# Altium project Pannel3.5x3.PrjPcb
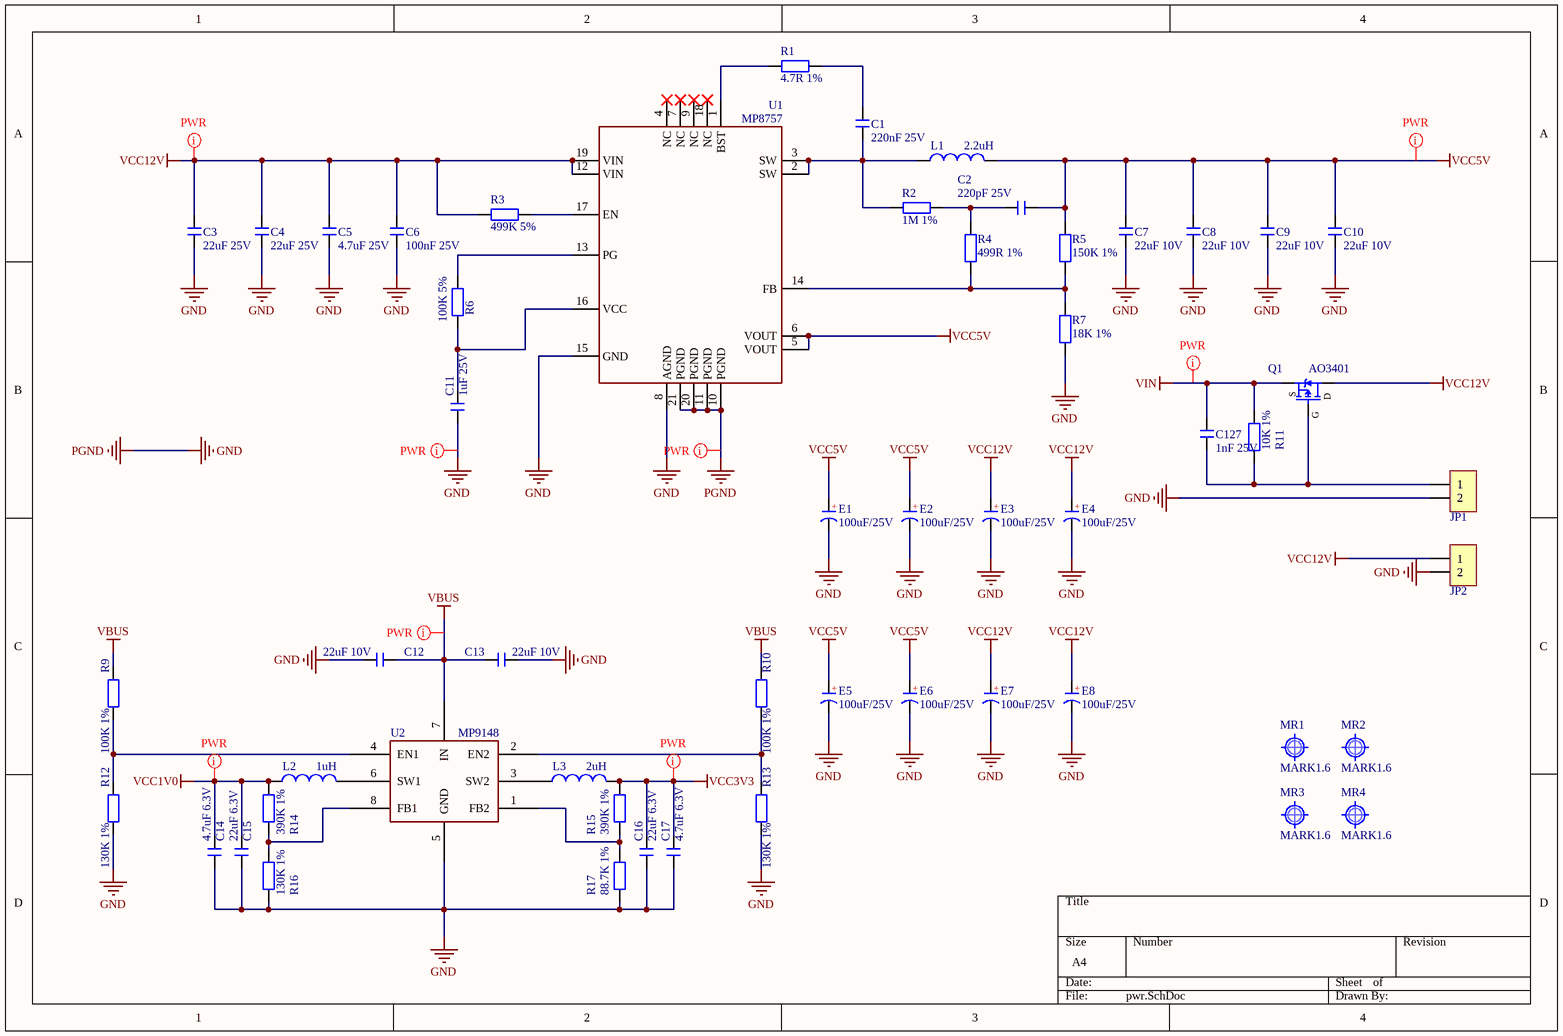
[diagram p0: pwr.SchDoc]
4 sheets, 234 parts. Net scope: global (net labels, ports and power ports of the same name join across sheets).
Board file: Pannel3.5x3.PcbDoc
Sheets:
  pwr.SchDoc
  connector.SchDoc
  jmb575.SchDoc
  vl822.SchDoc

## Sheet pwr.SchDoc
size A4; SheetNumber: 1; SheetTotal: 4

### Parts
C1  220nF 25V  [C0402_L]
C2  220pF 25V  [C0402_L]
C3  22uF 25V  [C0805_L]
C4  22uF 25V  [C0805_L]
C5  4.7uF 25V  [C0805_L]
C6  100nF 25V  [C0805_L]
C7  22uF 10V  [C0805_L]
C8  22uF 10V  [C0805_L]
C9  22uF 10V  [C0805_L]
C10  22uF 10V  [C0805_L]
C11  1uF 25V  [C0402_L]
C12  22uF 10V  [C0603_L]
C13  22uF 10V  [C0603_L]
C14  4.7uF 6.3V  [C0603_L]
C15  22uF 6.3V  [C0603_L]
C16  22uF 6.3V  [C0603_L]
C17  4.7uF 6.3V  [C0603_L]
C127  1nF 25V  [C0402_L]
E1  100uF/25V  [CS 6*4 - B]
E2  100uF/25V  [CS 6*4 - B]
E3  100uF/25V  [CS 6*4 - B]
E4  100uF/25V  [CS 6*4 - B]
E5  100uF/25V  [CS 6*4 - B]
E6  100uF/25V  [CS 6*4 - B]
E7  100uF/25V  [CS 6*4 - B]
E8  100uF/25V  [CS 6*4 - B]
JP1  HDR-1X2  [ZH1.5-WS-2P]  (value not drawn)
JP2  HDR-1X2  [XH2.54-WS-2P]  (value not drawn)
L1  2.2uH  [NR8040]
L2  1uH  [NR4020]
L3  2uH  [NR4020]
MR1  MARK1.6  [Mark 1]
MR2  MARK1.6  [Mark 1]
MR3  MARK1.6  [Mark 1]
MR4  MARK1.6  [Mark 1]
Q1  AO3401  [DFN8-L3.0-W3.0-P0.65_EP]
R1  4.7R 1%  [R0402_L]
R2  1M 1%  [R0402_L]
R3  499K 5%  [R0402_L]
R4  499R 1%  [R0402_L]
R5  150K 1%  [R0402_L]
R6  100K 5%  [R0402_L]
R7  18K 1%  [R0402_L]
R9  100K 1%  [R0402_L]
R10  100K 1%  [R0402_L]
R11  10K 1%  [R0402_L]
R12  130K 1%  [R0402_L]
R13  130K 1%  [R0402_L]
R14  390K 1%  [R0402_L]
R15  390K 1%  [R0402_L]
R16  130K 1%  [R0402_L]
R17  88.7K 1%  [R0402_L]
U1  MP8757  [MP8757]
U2  MP9148  [SOT23-8]

### Nets
GND: C3.1 C4.1 C5.1 C6.1 C7.1 C8.1 C9.1 C10.1 C11.1 C12.1 C13.1 C14.1 C15.1 C16.1 C17.1 E1.2(K) E2.2(K) E3.2(K) E4.2(K) E5.2(K) E6.2(K) E7.2(K) E8.2(K) JP1.2 JP2.2 R7.1 R12.2 R13.2 R16.2 R17.2 U1.8(AGND) U1.10(PGND) U1.11(PGND) U1.15(GND) U1.20(PGND) U1.21(PGND) U2.5(GND)  [also labelled PGND]
VBUS: C12.2 C13.2 R9.1 R10.1 U2.7(IN)
VCC1V0: C14.2 C15.2 L2.1 R14.1
VCC3V3: C16.2 C17.2 L3.1 R15.1
VCC5V: C2.1 C7.2 C8.2 C9.2 C10.2 E1.1(A) E2.1(A) E5.1(A) E6.1(A) L1.1 R5.2 U1.5(VOUT) U1.6(VOUT)
VCC12V: C3.2 C4.2 C5.2 C6.2 E3.1(A) E4.1(A) E7.1(A) E8.1(A) JP2.1 Q1.3(D) R3.1 U1.12(VIN) U1.19(VIN)
VIN: C127.1 Q1.2(S) R11.1
NetC1_1: C1.1 R1.2
NetC1_2: C1.2 L1.2 R2.1 U1.2(SW) U1.3(SW)
NetC2_2: C2.2 R2.2 R4.1
NetC11_2: C11.2 R6.1 U1.16(VCC)
NetC127_2: C127.2 JP1.1 Q1.1(G) R11.2
NetL2_2: L2.2 U2.6(SW1)
NetL3_2: L3.2 U2.3(SW2)
NetR1_1: R1.1 U1.1(BST)
NetR3_2: R3.2 U1.17(EN)
NetR4_2: R4.2 R5.1 R7.2 U1.14(FB)
NetR6_2: R6.2 U1.13(PG)
NetR9_2: R9.2 R12.1 U2.4(EN1)
NetR10_2: R10.2 R13.1 U2.2(EN2)
NetR14_2: R14.2 R16.1 U2.8(FB1)
NetR15_2: R15.2 R17.1 U2.1(FB2)

Not connected (* = marked no-connect by the designer): U1 4(NC)* 7(NC)* 9(NC)* 18(NC)*

### Layout directives
net class PWR: GND, VBUS, VCC1V0, VCC3V3, VCC5V, VCC12V, VIN

### Notes on the sheet
- (in symbol C-CD) +

### Library data of the parts
C1-C17 C127 = C: 无极性贴片电容; 版权归属: 源创客; 材质: X7R; BOM名称: 无极性贴片电容; 学习资源: www.ooocke.com
E1-E8 = C-CD: 贴片钽电容; 版权归属: 源创客; BOM名称: 贴片钽电容; 学习资源: www.ooocke.com
JP1 JP2 = Header 2: 2P接插件; 版权归属: 源创客; BOM名称: 2P接插件; 学习资源: www.ooocke.com
L1-L3 = L: 小功率贴片电感; 版权归属: 源创客; BOM名称: 小功率贴片电感; 学习资源: www.ooocke.com
MR1-MR4 = MARK: 光学定位点; 版权归属: 源创客; BOM名称: 光学定位点; 学习资源: www.ooocke.com
Q1 = AO3401: P沟道 30V/4.2A; BOM名称: 场效应管; 版权归属: 源创客; 学习资源: www.ooocke.com; 描述: P沟道 30V/4.2A
R1-R7 R9-R17 = R: 贴片电阻; 版权归属: 源创客; BOM名称: 贴片电阻; 学习资源: www.ooocke.com
U1 = MP8757: DCDC控制器
U2 = MP9148: BUCK

## Sheet connector.SchDoc
size A4; SheetNumber: 2; SheetTotal: 4
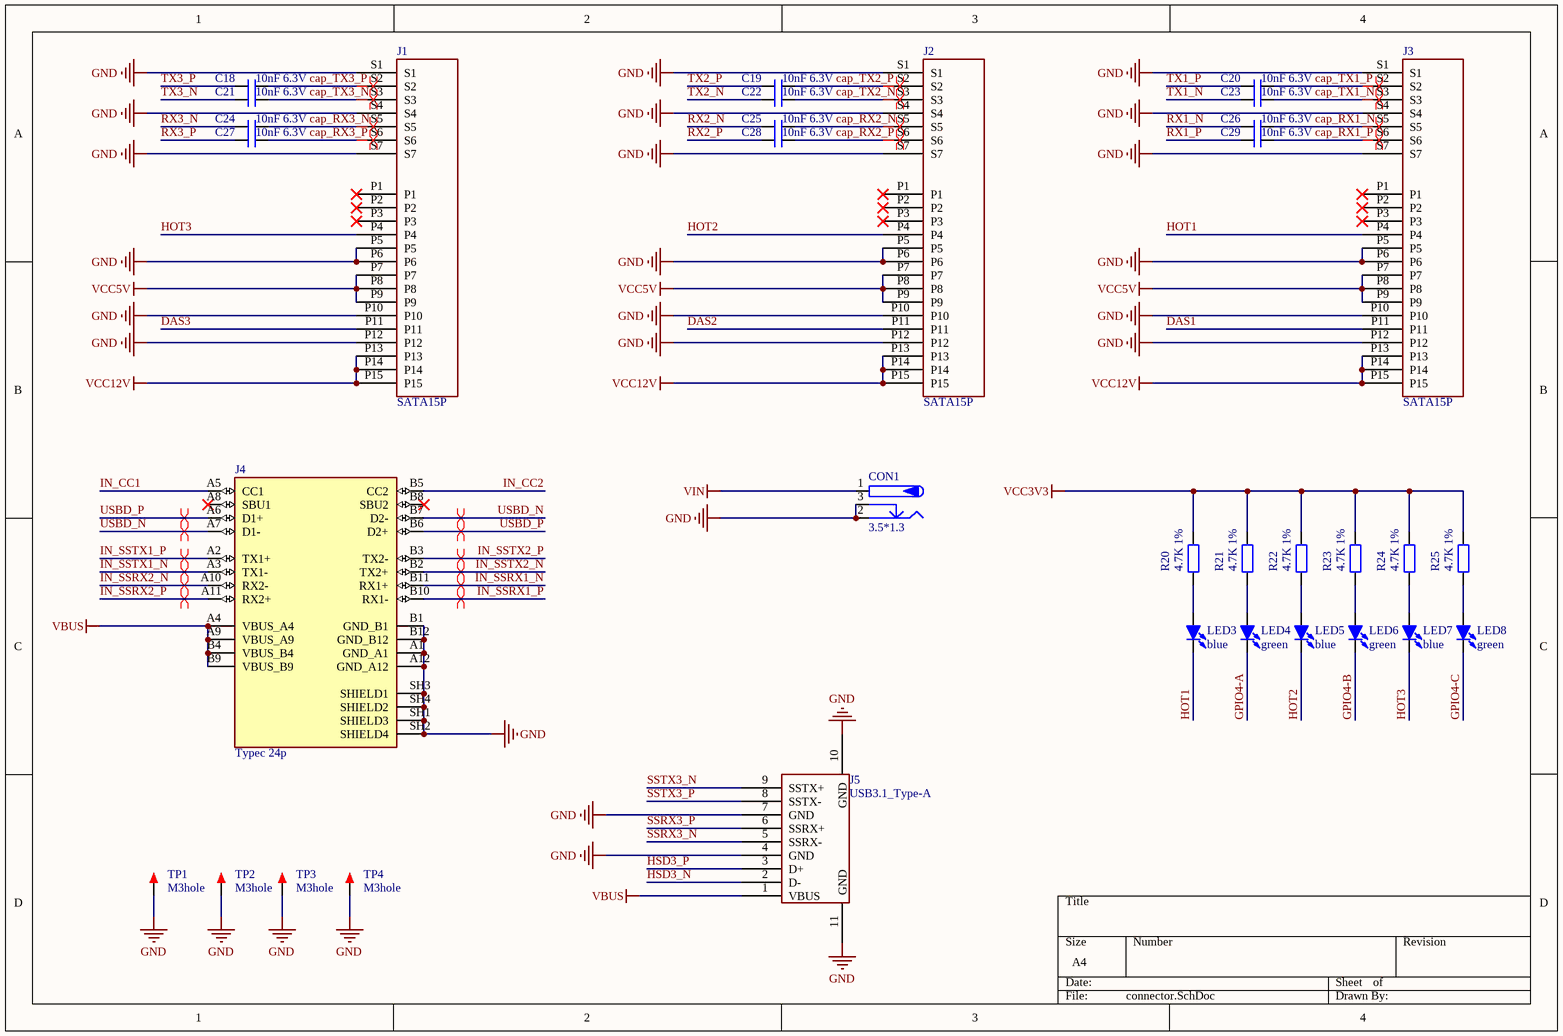
[diagram p1: connector.SchDoc]

### Parts
C18  10nF 6.3V  [C0402_L]
C19  10nF 6.3V  [C0402_L]
C20  10nF 6.3V  [C0402_L]
C21  10nF 6.3V  [C0402_L]
C22  10nF 6.3V  [C0402_L]
C23  10nF 6.3V  [C0402_L]
C24  10nF 6.3V  [C0402_L]
C25  10nF 6.3V  [C0402_L]
C26  10nF 6.3V  [C0402_L]
C27  10nF 6.3V  [C0402_L]
C28  10nF 6.3V  [C0402_L]
C29  10nF 6.3V  [C0402_L]
CON1  3.5*1.3  [DC-012]
J1  SATA15P  [SATA 15P 贴片]
J2  SATA15P  [SATA 15P 贴片]
J3  SATA15P  [SATA 15P 贴片]
J4  Typec 24p  [TypeC 24p 直立]
J5  USB3.1_Type-A  [USB3.1_Type-A 立式直插]
LED3  blue  [LED 0805B]
LED4  green  [LED 0805G]
LED5  blue  [LED 0805B]
LED6  green  [LED 0805G]
LED7  blue  [LED 0805B]
LED8  green  [LED 0805G]
R20  4.7K 1%  [R0402_L]
R21  4.7K 1%  [R0402_L]
R22  4.7K 1%  [R0402_L]
R23  4.7K 1%  [R0402_L]
R24  4.7K 1%  [R0402_L]
R25  4.7K 1%  [R0402_L]
TP1  M3hole  [m3内嵌螺母贴片]
TP2  M3hole  [m3内嵌螺母贴片]
TP3  M3hole  [m3内嵌螺母贴片]
TP4  M3hole  [m3内嵌螺母贴片]

### Nets
GND: CON1.2 CON1.3 J1.P5 J1.P6 J1.P10 J1.P12 J1.S1 J1.S4 J1.S7 J2.P5 J2.P6 J2.P10 J2.P12 J2.S1 J2.S4 J2.S7 J3.P5 J3.P6 J3.P10 J3.P12 J3.S1 J3.S4 J3.S7 J4.A1(GND_A1) J4.A12(GND_A12) J4.B1(GND_B1) J4.B12(GND_B12) J4.SH1(SHIELD3) J4.SH2(SHIELD4) J4.SH3(SHIELD1) J4.SH4(SHIELD2) J5.4(GND) J5.7(GND) J5.10(GND) J5.11(GND) TP1.1 TP2.1 TP3.1 TP4.1
VBUS: J4.A4(VBUS_A4) J4.A9(VBUS_A9) J4.B4(VBUS_B4) J4.B9(VBUS_B9) J5.1(VBUS)
VCC3V3: R20.1 R21.1 R22.1 R23.1 R24.1 R25.1
VCC5V: J1.P7 J1.P8 J1.P9 J2.P7 J2.P8 J2.P9 J3.P7 J3.P8 J3.P9
VCC12V: J1.P13 J1.P14 J1.P15 J2.P13 J2.P14 J2.P15 J3.P13 J3.P14 J3.P15
VIN: CON1.1
cap_RX1_N: C26.1 J3.S5
cap_RX1_P: C29.1 J3.S6
cap_RX2_N: C25.1 J2.S5
cap_RX2_P: C28.1 J2.S6
cap_RX3_N: C24.1 J1.S5
cap_RX3_P: C27.1 J1.S6
cap_TX1_N: C23.1 J3.S3
cap_TX1_P: C20.1 J3.S2
cap_TX2_N: C22.1 J2.S3
cap_TX2_P: C19.1 J2.S2
cap_TX3_N: C21.1 J1.S3
cap_TX3_P: C18.1 J1.S2
DAS1: J3.P11
DAS2: J2.P11
DAS3: J1.P11
GPIO4-A: LED4.2(K)
GPIO4-B: LED6.2(K)
GPIO4-C: LED8.2(K)
HOT1: J3.P4 LED3.2(K)
HOT2: J2.P4 LED5.2(K)
HOT3: J1.P4 LED7.2(K)
HSD3_N: J5.2(D-)
HSD3_P: J5.3(D+)
IN_CC1: J4.A5(CC1)
IN_CC2: J4.B5(CC2)
IN_SSRX1_N: J4.B11(RX1+)
IN_SSRX1_P: J4.B10(RX1-)
IN_SSRX2_N: J4.A10(RX2-)
IN_SSRX2_P: J4.A11(RX2+)
IN_SSTX1_N: J4.A3(TX1-)
IN_SSTX1_P: J4.A2(TX1+)
IN_SSTX2_N: J4.B2(TX2+)
IN_SSTX2_P: J4.B3(TX2-)
RX1_N: C26.2
RX1_P: C29.2
RX2_N: C25.2
RX2_P: C28.2
RX3_N: C24.2
RX3_P: C27.2
SSRX3_N: J5.5(SSRX-)
SSRX3_P: J5.6(SSRX+)
SSTX3_N: J5.9(SSTX+)
SSTX3_P: J5.8(SSTX-)
TX1_N: C23.2
TX1_P: C20.2
TX2_N: C22.2
TX2_P: C19.2
TX3_N: C21.2
TX3_P: C18.2
USBD_N: J4.A7(D1-) J4.B7(D2-)
USBD_P: J4.A6(D1+) J4.B6(D2+)
NetLED3_1: LED3.1(A) R20.2
NetLED4_1: LED4.1(A) R21.2
NetLED5_1: LED5.1(A) R22.2
NetLED6_1: LED6.1(A) R23.2
NetLED7_1: LED7.1(A) R24.2
NetLED8_1: LED8.1(A) R25.2

Not connected (* = marked no-connect by the designer): J1 P1* P2* P3*; J2 P1* P2* P3*; J3 P1* P2* P3*; J4 A8(SBU1)* B8(SBU2)*

### Layout directives
differential pair: cap_RX1_N, cap_RX1_P, cap_RX2_N, cap_RX2_P, cap_RX3_N, cap_RX3_P, cap_TX1_N, cap_TX1_P, cap_TX2_N, cap_TX2_P, cap_TX3_N, cap_TX3_P, IN_SSRX1_N, IN_SSRX1_P, IN_SSRX2_N, IN_SSRX2_P, IN_SSTX1_N, IN_SSTX1_P, IN_SSTX2_N, IN_SSTX2_P, USBD_N, USBD_P

### Library data of the parts
C18-C29 = C: 无极性贴片电容; 版权归属: 源创客; 材质: X7R; BOM名称: 无极性贴片电容; 学习资源: www.ooocke.com
CON1 = P-DC: 低压电源接口; BOM名称: DC电源接口; 版权归属: 源创客; 学习资源: www.ooocke.com
J4 = Typec 24p: USB-C (USB TYPE-C) USB 3.2 Gen 2 (USB 3.1 Gen 2, Superspeed + (USB 3.1)) Receptacle Connector 24 Position Surface Mount, Right Angle; Through Hole; MF: Molex; MP: 1054500101; SnapEDA_Link: https://www.snapeda.com/parts/1054500101/Molex/view-part/?ref=snap; Package: None; Value: *; Check_prices: https://www.snapeda.com/parts/1054500101/Molex/view-part/?ref=eda
J5 = USB3.1_Type-A: USB接口
LED3-LED8 = LED-3MM: 插件LED; 版权归属: 源创客; BOM名称: 插件LED; 学习资源: www.ooocke.com
R20-R25 = R: 贴片电阻; 版权归属: 源创客; BOM名称: 贴片电阻; 学习资源: www.ooocke.com
TP1-TP4 = TEST: 测试点; 版权归属: 源创客; BOM名称: 测试点; 学习资源: www.ooocke.com

## Sheet jmb575.SchDoc
size A2; SheetNumber: 3; SheetTotal: 4
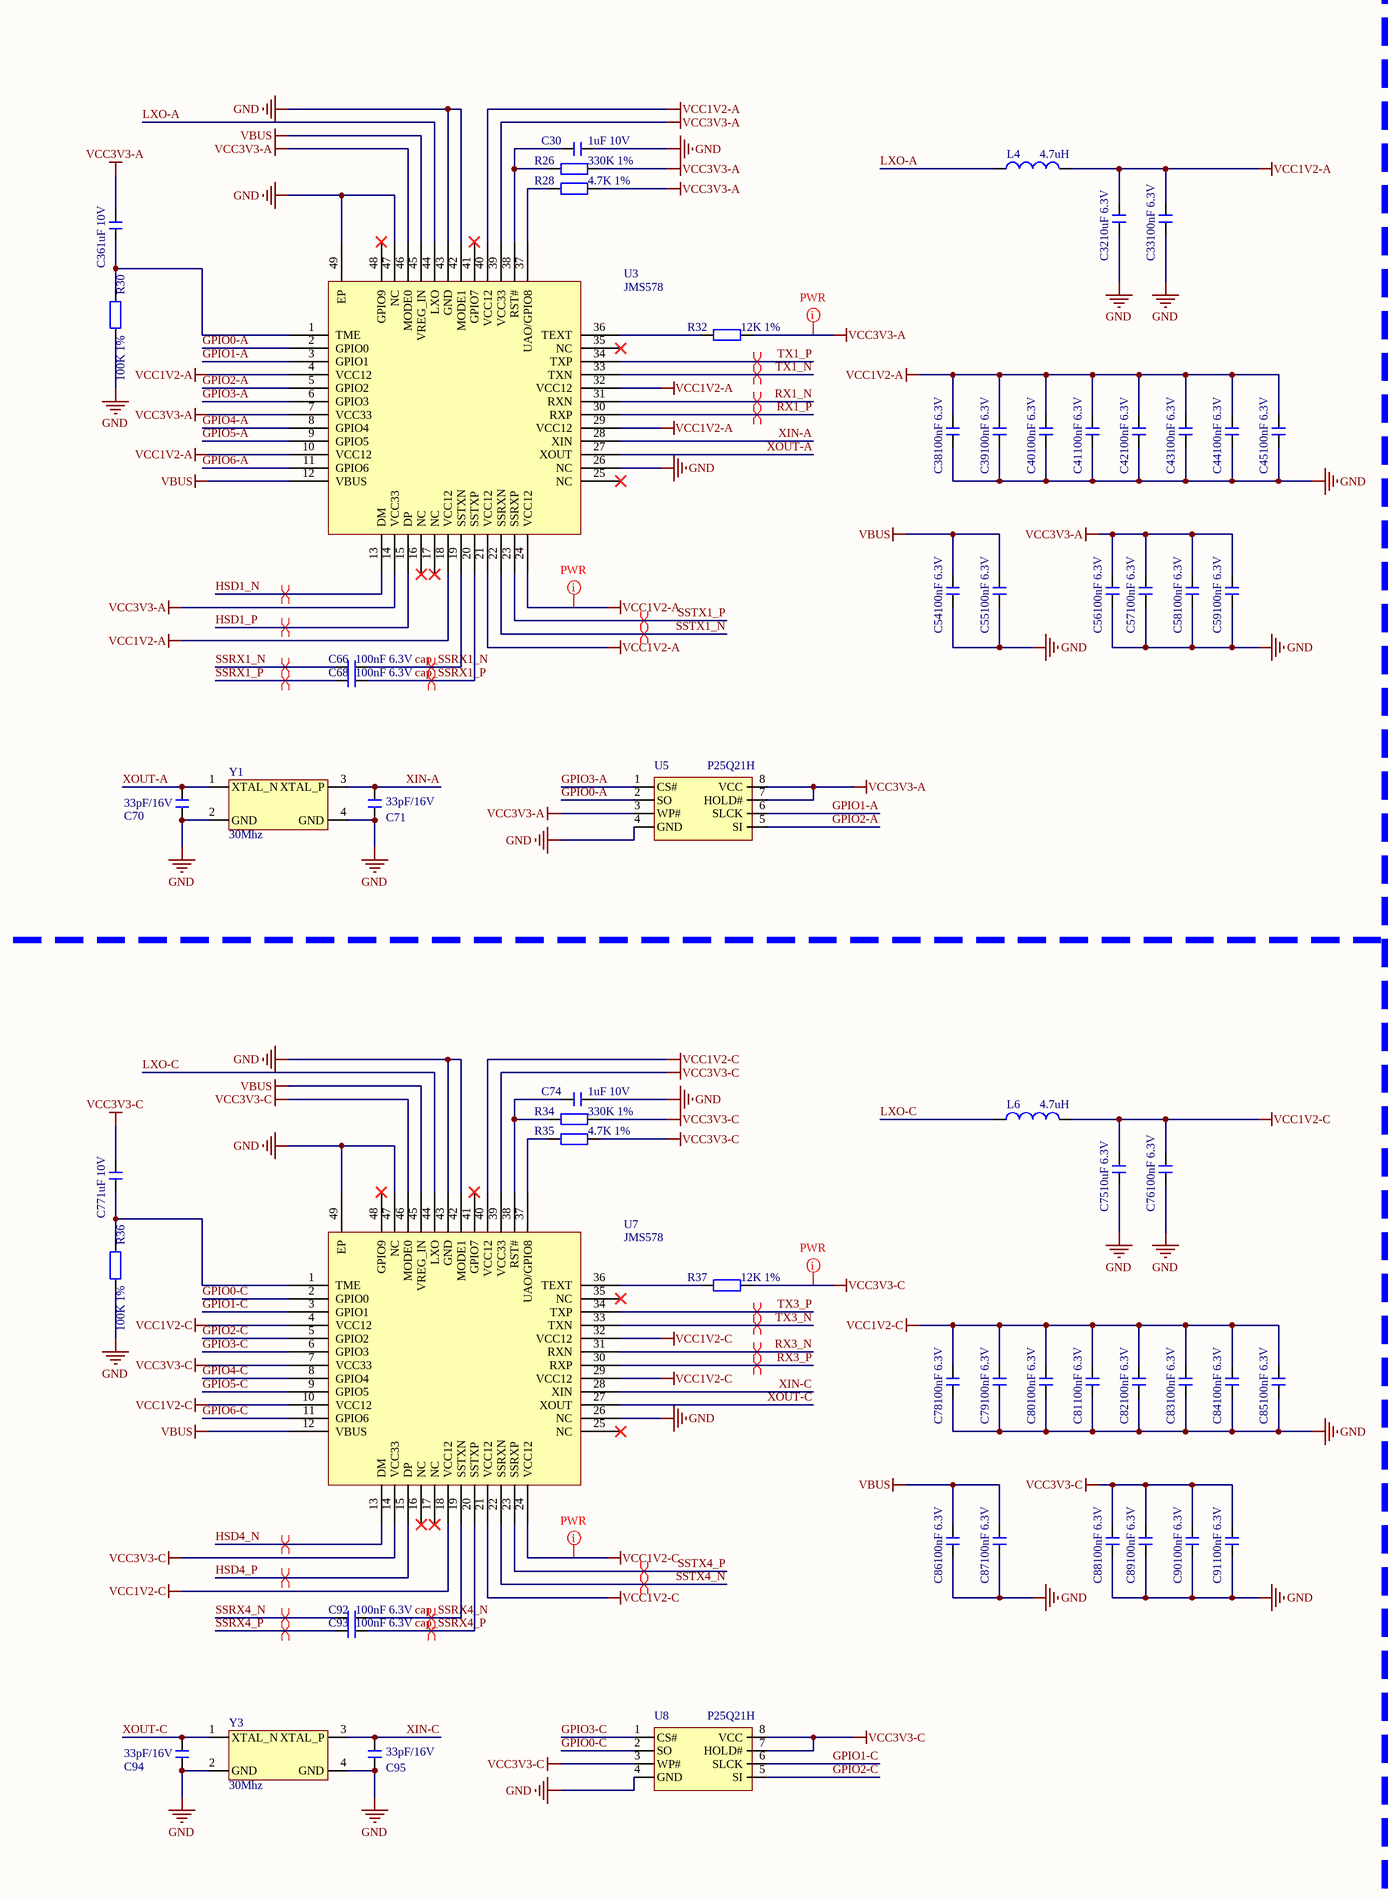
[diagram p2: jmb575.SchDoc, left]
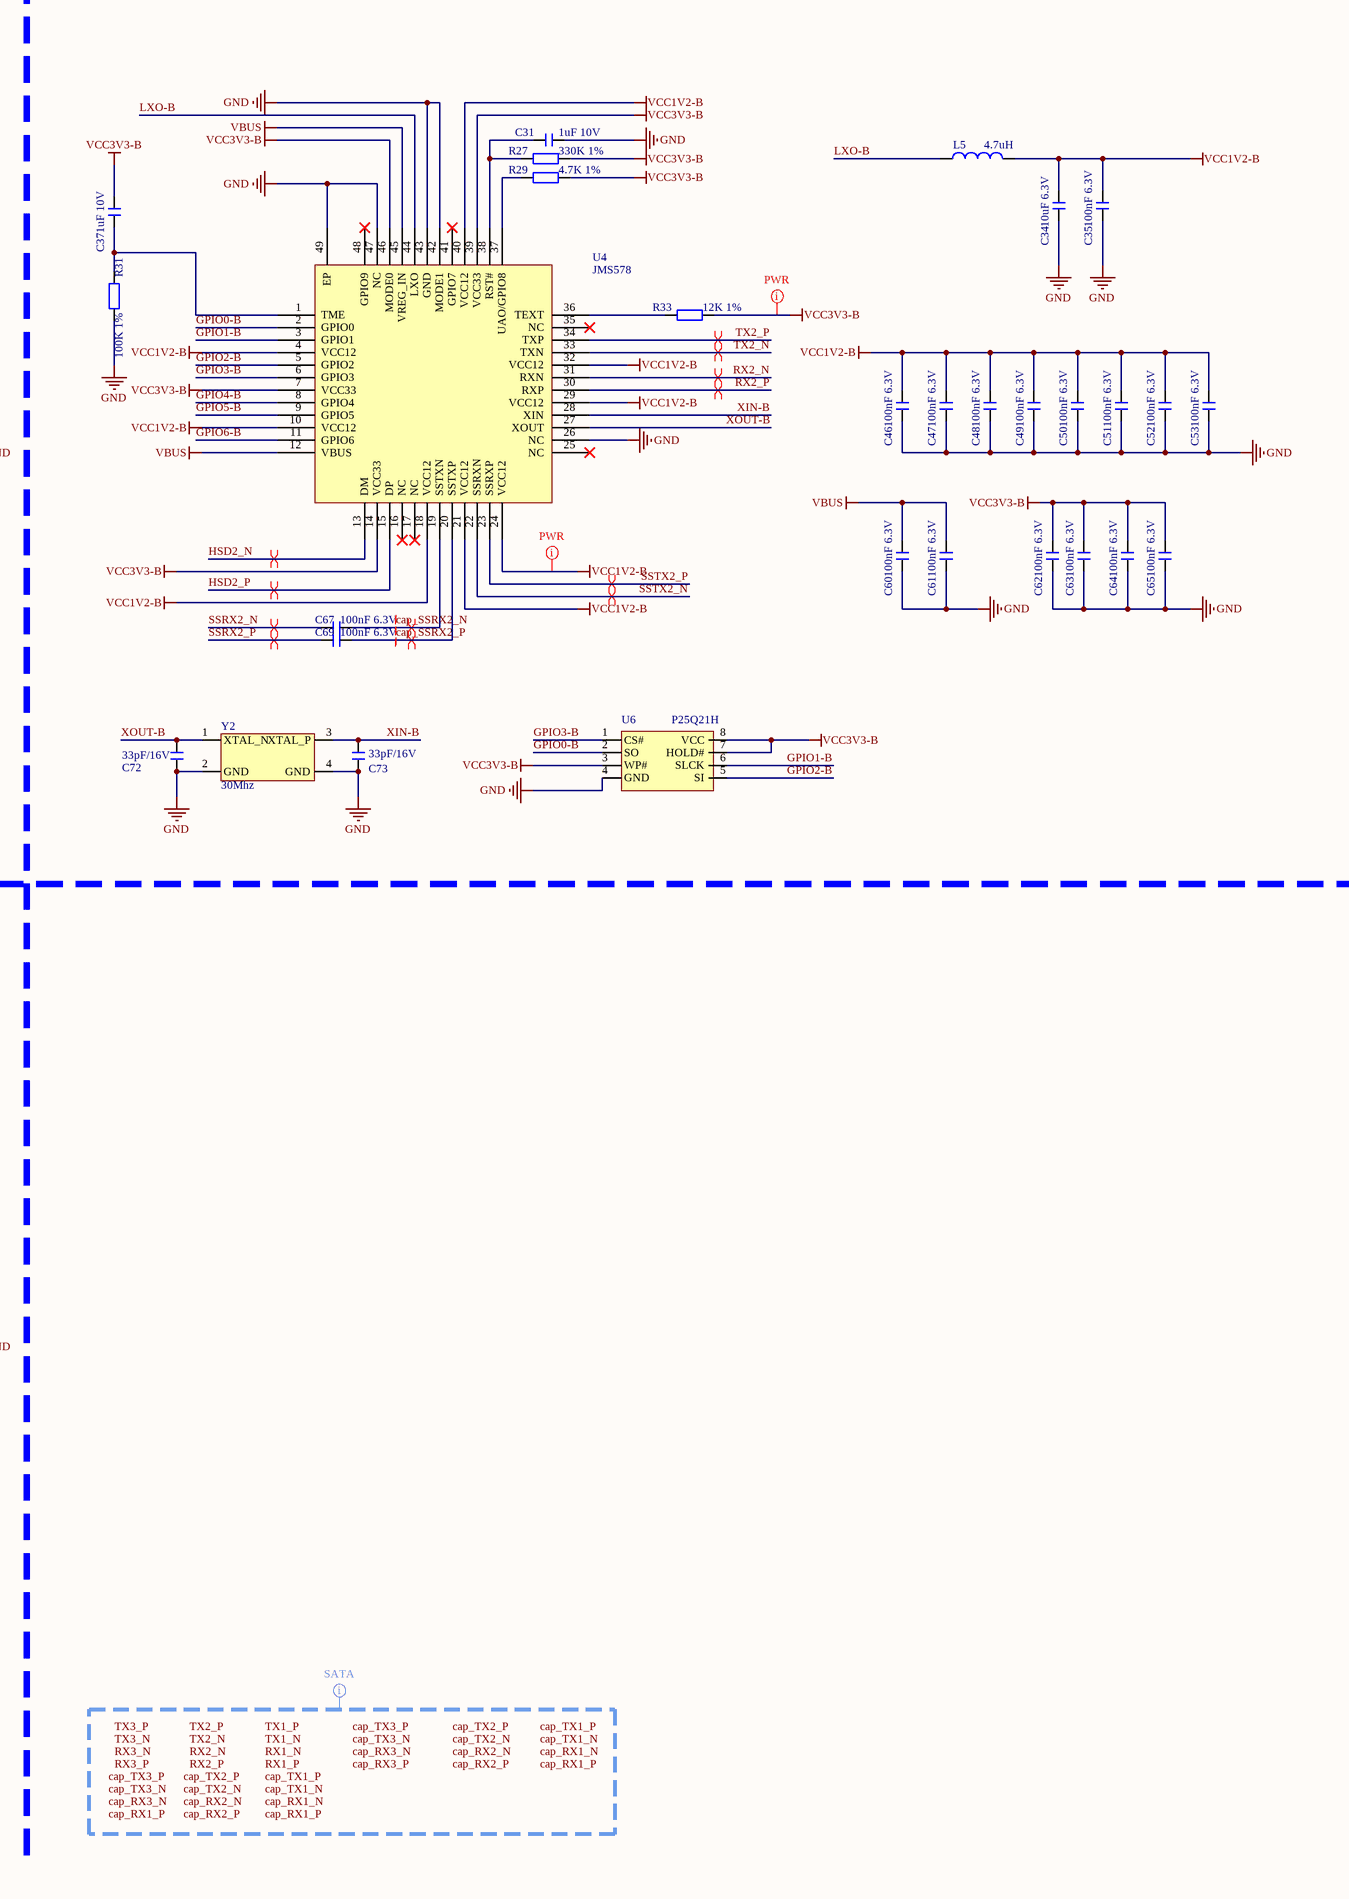
[diagram p3: jmb575.SchDoc, right]

### Parts
C30  1uF 10V  [C0402_L]
C31  1uF 10V  [C0402_L]
C32  10uF 6.3V  [C0603_L]
C33  100nF 6.3V  [C0402_L]
C34  10uF 6.3V  [C0603_L]
C35  100nF 6.3V  [C0402_L]
C36  1uF 10V  [C0402_L]
C37  1uF 10V  [C0402_L]
C38  100nF 6.3V  [C0402_L]
C39  100nF 6.3V  [C0402_L]
C40  100nF 6.3V  [C0402_L]
C41  100nF 6.3V  [C0402_L]
C42  100nF 6.3V  [C0402_L]
C43  100nF 6.3V  [C0402_L]
C44  100nF 6.3V  [C0402_L]
C45  100nF 6.3V  [C0402_L]
C46  100nF 6.3V  [C0402_L]
C47  100nF 6.3V  [C0402_L]
C48  100nF 6.3V  [C0402_L]
C49  100nF 6.3V  [C0402_L]
C50  100nF 6.3V  [C0402_L]
C51  100nF 6.3V  [C0402_L]
C52  100nF 6.3V  [C0402_L]
C53  100nF 6.3V  [C0402_L]
C54  100nF 6.3V  [C0402_L]
C55  100nF 6.3V  [C0402_L]
C56  100nF 6.3V  [C0402_L]
C57  100nF 6.3V  [C0402_L]
C58  100nF 6.3V  [C0402_L]
C59  100nF 6.3V  [C0402_L]
C60  100nF 6.3V  [C0402_L]
C61  100nF 6.3V  [C0402_L]
C62  100nF 6.3V  [C0402_L]
C63  100nF 6.3V  [C0402_L]
C64  100nF 6.3V  [C0402_L]
C65  100nF 6.3V  [C0402_L]
C66  100nF 6.3V  [C0402_L]
C67  100nF 6.3V  [C0402_L]
C68  100nF 6.3V  [C0402_L]
C69  100nF 6.3V  [C0402_L]
C70  33pF/16V  [C0402_L]
C71  33pF/16V  [C0402_L]
C72  33pF/16V  [C0402_L]
C73  33pF/16V  [C0402_L]
C74  1uF 10V  [C0402_L]
C75  10uF 6.3V  [C0603_L]
C76  100nF 6.3V  [C0402_L]
C77  1uF 10V  [C0402_L]
C78  100nF 6.3V  [C0402_L]
C79  100nF 6.3V  [C0402_L]
C80  100nF 6.3V  [C0402_L]
C81  100nF 6.3V  [C0402_L]
C82  100nF 6.3V  [C0402_L]
C83  100nF 6.3V  [C0402_L]
C84  100nF 6.3V  [C0402_L]
C85  100nF 6.3V  [C0402_L]
C86  100nF 6.3V  [C0402_L]
C87  100nF 6.3V  [C0402_L]
C88  100nF 6.3V  [C0402_L]
C89  100nF 6.3V  [C0402_L]
C90  100nF 6.3V  [C0402_L]
C91  100nF 6.3V  [C0402_L]
C92  100nF 6.3V  [C0402_L]
C93  100nF 6.3V  [C0402_L]
C94  33pF/16V  [C0402_L]
C95  33pF/16V  [C0402_L]
L4  4.7uH  [NR2520]
L5  4.7uH  [NR2520]
L6  4.7uH  [NR2520]
R26  330K 1%  [R0402_L]
R27  330K 1%  [R0402_L]
R28  4.7K 1%  [R0402_L]
R29  4.7K 1%  [R0402_L]
R30  100K 1%  [R0402_L]
R31  100K 1%  [R0402_L]
R32  12K 1%  [R0402_L]
R33  12K 1%  [R0402_L]
R34  330K 1%  [R0402_L]
R35  4.7K 1%  [R0402_L]
R36  100K 1%  [R0402_L]
R37  12K 1%  [R0402_L]
U3  JMS578  [QFN48-L6.0-W6.0-P0.4]
U4  JMS578  [QFN48-L6.0-W6.0-P0.4]
U5  P25Q21H  [SOP8_L]
U6  P25Q21H  [SOP8_L]
U7  JMS578  [QFN48-L6.0-W6.0-P0.4]
U8  P25Q21H  [SOP8_L]
Y1  30Mhz  [OSC 3225-4P]
Y2  30Mhz  [OSC 3225-4P]
Y3  30Mhz  [OSC 3225-4P]

### Nets
GND: C30.1 C31.1 C32.1 C33.1 C34.1 C35.1 C38.1 C39.1 C40.1 C41.1 C42.1 C43.1 C44.1 C45.1 C46.1 C47.1 C48.1 C49.1 C50.1 C51.1 C52.1 C53.1 C54.1 C55.1 C56.1 C57.1 C58.1 C59.1 C60.1 C61.1 C62.1 C63.1 C64.1 C65.1 C70.2 C71.2 C72.2 C73.2 C74.1 C75.1 C76.1 C78.1 C79.1 C80.1 C81.1 C82.1 C83.1 C84.1 C85.1 C86.1 C87.1 C88.1 C89.1 C90.1 C91.1 C94.2 C95.2 R30.1 R31.1 R36.1 U3.26(NC) U3.42(MODE1) U3.43(GND) U3.47(NC) U3.49(EP) U4.26(NC) U4.42(MODE1) U4.43(GND) U4.47(NC) U4.49(EP) U5.4(GND) U6.4(GND) U7.26(NC) U7.42(MODE1) U7.43(GND) U7.47(NC) U7.49(EP) U8.4(GND) Y1.2(GND) Y1.4(GND) Y2.2(GND) Y2.4(GND) Y3.2(GND) Y3.4(GND)
VBUS: C54.2 C55.2 C60.2 C61.2 C86.2 C87.2 U3.12(VBUS) U3.45(VREG_IN) U4.12(VBUS) U4.45(VREG_IN) U7.12(VBUS) U7.45(VREG_IN)
VCC1V2-A: C32.2 C33.2 C38.2 C39.2 C40.2 C41.2 C42.2 C43.2 C44.2 C45.2 L4.2 U3.4(VCC12) U3.10(VCC12) U3.18(VCC12) U3.21(VCC12) U3.24(VCC12) U3.29(VCC12) U3.32(VCC12) U3.40(VCC12)
VCC1V2-B: C34.2 C35.2 C46.2 C47.2 C48.2 C49.2 C50.2 C51.2 C52.2 C53.2 L5.2 U4.4(VCC12) U4.10(VCC12) U4.18(VCC12) U4.21(VCC12) U4.24(VCC12) U4.29(VCC12) U4.32(VCC12) U4.40(VCC12)
VCC1V2-C: C75.2 C76.2 C78.2 C79.2 C80.2 C81.2 C82.2 C83.2 C84.2 C85.2 L6.2 U7.4(VCC12) U7.10(VCC12) U7.18(VCC12) U7.21(VCC12) U7.24(VCC12) U7.29(VCC12) U7.32(VCC12) U7.40(VCC12)
VCC3V3-A: C36.2 C56.2 C57.2 C58.2 C59.2 R26.1 R28.1 R32.1 U3.7(VCC33) U3.14(VCC33) U3.39(VCC33) U3.46(MODE0) U5.3(WP#) U5.7(HOLD#) U5.8(VCC)
VCC3V3-B: C37.2 C62.2 C63.2 C64.2 C65.2 R27.1 R29.1 R33.1 U4.7(VCC33) U4.14(VCC33) U4.39(VCC33) U4.46(MODE0) U6.3(WP#) U6.7(HOLD#) U6.8(VCC)
VCC3V3-C: C77.2 C88.2 C89.2 C90.2 C91.2 R34.1 R35.1 R37.1 U7.7(VCC33) U7.14(VCC33) U7.39(VCC33) U7.46(MODE0) U8.3(WP#) U8.7(HOLD#) U8.8(VCC)
cap_SSRX1_N: C66.2 U3.19(SSTXN)
cap_SSRX1_P: C68.2 U3.20(SSTXP)
cap_SSRX2_N: C67.2 U4.19(SSTXN)
cap_SSRX2_P: C69.2 U4.20(SSTXP)
cap_SSRX4_N: C92.2 U7.19(SSTXN)
cap_SSRX4_P: C93.2 U7.20(SSTXP)
GPIO0-A: U3.2(GPIO0) U5.2(SO)
GPIO0-B: U4.2(GPIO0) U6.2(SO)
GPIO0-C: U7.2(GPIO0) U8.2(SO)
GPIO1-A: U3.3(GPIO1) U5.6(SLCK)
GPIO1-B: U4.3(GPIO1) U6.6(SLCK)
GPIO1-C: U7.3(GPIO1) U8.6(SLCK)
GPIO2-A: U3.5(GPIO2) U5.5(SI)
GPIO2-B: U4.5(GPIO2) U6.5(SI)
GPIO2-C: U7.5(GPIO2) U8.5(SI)
GPIO3-A: U3.6(GPIO3) U5.1(CS#)
GPIO3-B: U4.6(GPIO3) U6.1(CS#)
GPIO3-C: U7.6(GPIO3) U8.1(CS#)
GPIO4-A: U3.8(GPIO4)
GPIO4-B: U4.8(GPIO4)
GPIO4-C: U7.8(GPIO4)
GPIO5-A: U3.9(GPIO5)
GPIO5-B: U4.9(GPIO5)
GPIO5-C: U7.9(GPIO5)
GPIO6-A: U3.11(GPIO6)
GPIO6-B: U4.11(GPIO6)
GPIO6-C: U7.11(GPIO6)
HSD1_N: U3.13(DM)
HSD1_P: U3.15(DP)
HSD2_N: U4.13(DM)
HSD2_P: U4.15(DP)
HSD4_N: U7.13(DM)
HSD4_P: U7.15(DP)
LXO-A: L4.1 U3.44(LXO)
LXO-B: L5.1 U4.44(LXO)
LXO-C: L6.1 U7.44(LXO)
RX1_N: U3.31(RXN)
RX1_P: U3.30(RXP)
RX2_N: U4.31(RXN)
RX2_P: U4.30(RXP)
RX3_N: U7.31(RXN)
RX3_P: U7.30(RXP)
SSRX1_N: C66.1
SSRX1_P: C68.1
SSRX2_N: C67.1
SSRX2_P: C69.1
SSRX4_N: C92.1
SSRX4_P: C93.1
SSTX1_N: U3.22(SSRXN)
SSTX1_P: U3.23(SSRXP)
SSTX2_N: U4.22(SSRXN)
SSTX2_P: U4.23(SSRXP)
SSTX4_N: U7.22(SSRXN)
SSTX4_P: U7.23(SSRXP)
TX1_N: U3.33(TXN)
TX1_P: U3.34(TXP)
TX2_N: U4.33(TXN)
TX2_P: U4.34(TXP)
TX3_N: U7.33(TXN)
TX3_P: U7.34(TXP)
XIN-A: C71.1 U3.28(XIN) Y1.3(XTAL_P)
XIN-B: C73.1 U4.28(XIN) Y2.3(XTAL_P)
XIN-C: C95.1 U7.28(XIN) Y3.3(XTAL_P)
XOUT-A: C70.1 U3.27(XOUT) Y1.1(XTAL_N)
XOUT-B: C72.1 U4.27(XOUT) Y2.1(XTAL_N)
XOUT-C: C94.1 U7.27(XOUT) Y3.1(XTAL_N)
NetC30_2: C30.2 R26.2 U3.38(RST#)
NetC31_2: C31.2 R27.2 U4.38(RST#)
NetC36_1: C36.1 R30.2 U3.1(TME)
NetC37_1: C37.1 R31.2 U4.1(TME)
NetC74_2: C74.2 R34.2 U7.38(RST#)
NetC77_1: C77.1 R36.2 U7.1(TME)
NetR28_2: R28.2 U3.37(UAO/GPIO8)
NetR29_2: R29.2 U4.37(UAO/GPIO8)
NetR32_2: R32.2 U3.36(TEXT)
NetR33_2: R33.2 U4.36(TEXT)
NetR35_2: R35.2 U7.37(UAO/GPIO8)
NetR37_2: R37.2 U7.36(TEXT)

Not connected (* = marked no-connect by the designer): U3 16(NC)* 17(NC)* 25(NC)* 35(NC)* 41(GPIO7)* 48(GPIO9)*; U4 16(NC)* 17(NC)* 25(NC)* 35(NC)* 41(GPIO7)* 48(GPIO9)*; U7 16(NC)* 17(NC)* 25(NC)* 35(NC)* 41(GPIO7)* 48(GPIO9)*

### Layout directives
differential pair: cap_SSRX1_N, cap_SSRX1_P, cap_SSRX2_N, cap_SSRX2_P, cap_SSRX4_N, cap_SSRX4_P, HSD1_N, HSD1_P, HSD2_N, HSD2_P, HSD4_N, HSD4_P, RX1_N, RX1_P, RX2_N, RX2_P, RX3_N, RX3_P, SSRX1_N, SSRX1_P, SSRX2_N, SSRX2_P, SSRX4_N, SSRX4_P, SSTX1_N, SSTX1_P, SSTX2_N, SSTX2_P, SSTX4_N, SSTX4_P, TX1_N, TX1_P, TX2_N, TX2_P, TX3_N, TX3_P
net class PWR: VCC1V2-A, VCC1V2-B, VCC1V2-C, VCC3V3-A, VCC3V3-B, VCC3V3-C
net class SATA; rule Differential Pairs Routing [Pref Gap = 6mil    Min Gap  = 6mil    Max Gap  = 6milPref Width = 4.29mil    Min Width  = 4.29mil    Max Width  = 4.29mil]; rule Routing Via Style [Pref Size = 0.4mm    Pref Hole Size = 0.3mm]: cap_RX1_N, cap_RX1_P, cap_RX2_N, cap_RX2_P, cap_RX3_N, cap_RX3_P, cap_TX1_N, cap_TX1_P, cap_TX2_N, cap_TX2_P, cap_TX3_N, cap_TX3_P, RX1_N, RX1_P, RX2_N, RX2_P, RX3_N, RX3_P, TX1_N, TX1_P, TX2_N, TX2_P, TX3_N, TX3_P

### Notes on the sheet
- Labels drawn without touching a wire or pin: cap_RX1_N, cap_RX1_P, cap_RX2_N, cap_RX2_P, cap_RX3_N, cap_RX3_P, cap_TX1_N, cap_TX1_P, cap_TX2_N, cap_TX2_P, cap_TX3_N, cap_TX3_P, RX1_N, RX1_P, RX2_N, RX2_P, RX3_N, RX3_P, TX1_N, TX1_P, TX2_N, TX2_P, TX3_N, TX3_P

### Library data of the parts
C30-C95 = C: 无极性贴片电容; 版权归属: 源创客; 材质: X7R; BOM名称: 无极性贴片电容; 学习资源: www.ooocke.com
L4-L6 = L: 小功率贴片电感; 版权归属: 源创客; BOM名称: 小功率贴片电感; 学习资源: www.ooocke.com
R26-R37 = R: 贴片电阻; 版权归属: 源创客; BOM名称: 贴片电阻; 学习资源: www.ooocke.com
U5 U6 U8 = P25D40H
Y1-Y3 = Crystal

## Sheet vl822.SchDoc
size A3; SheetNumber: 4; SheetTotal: 4
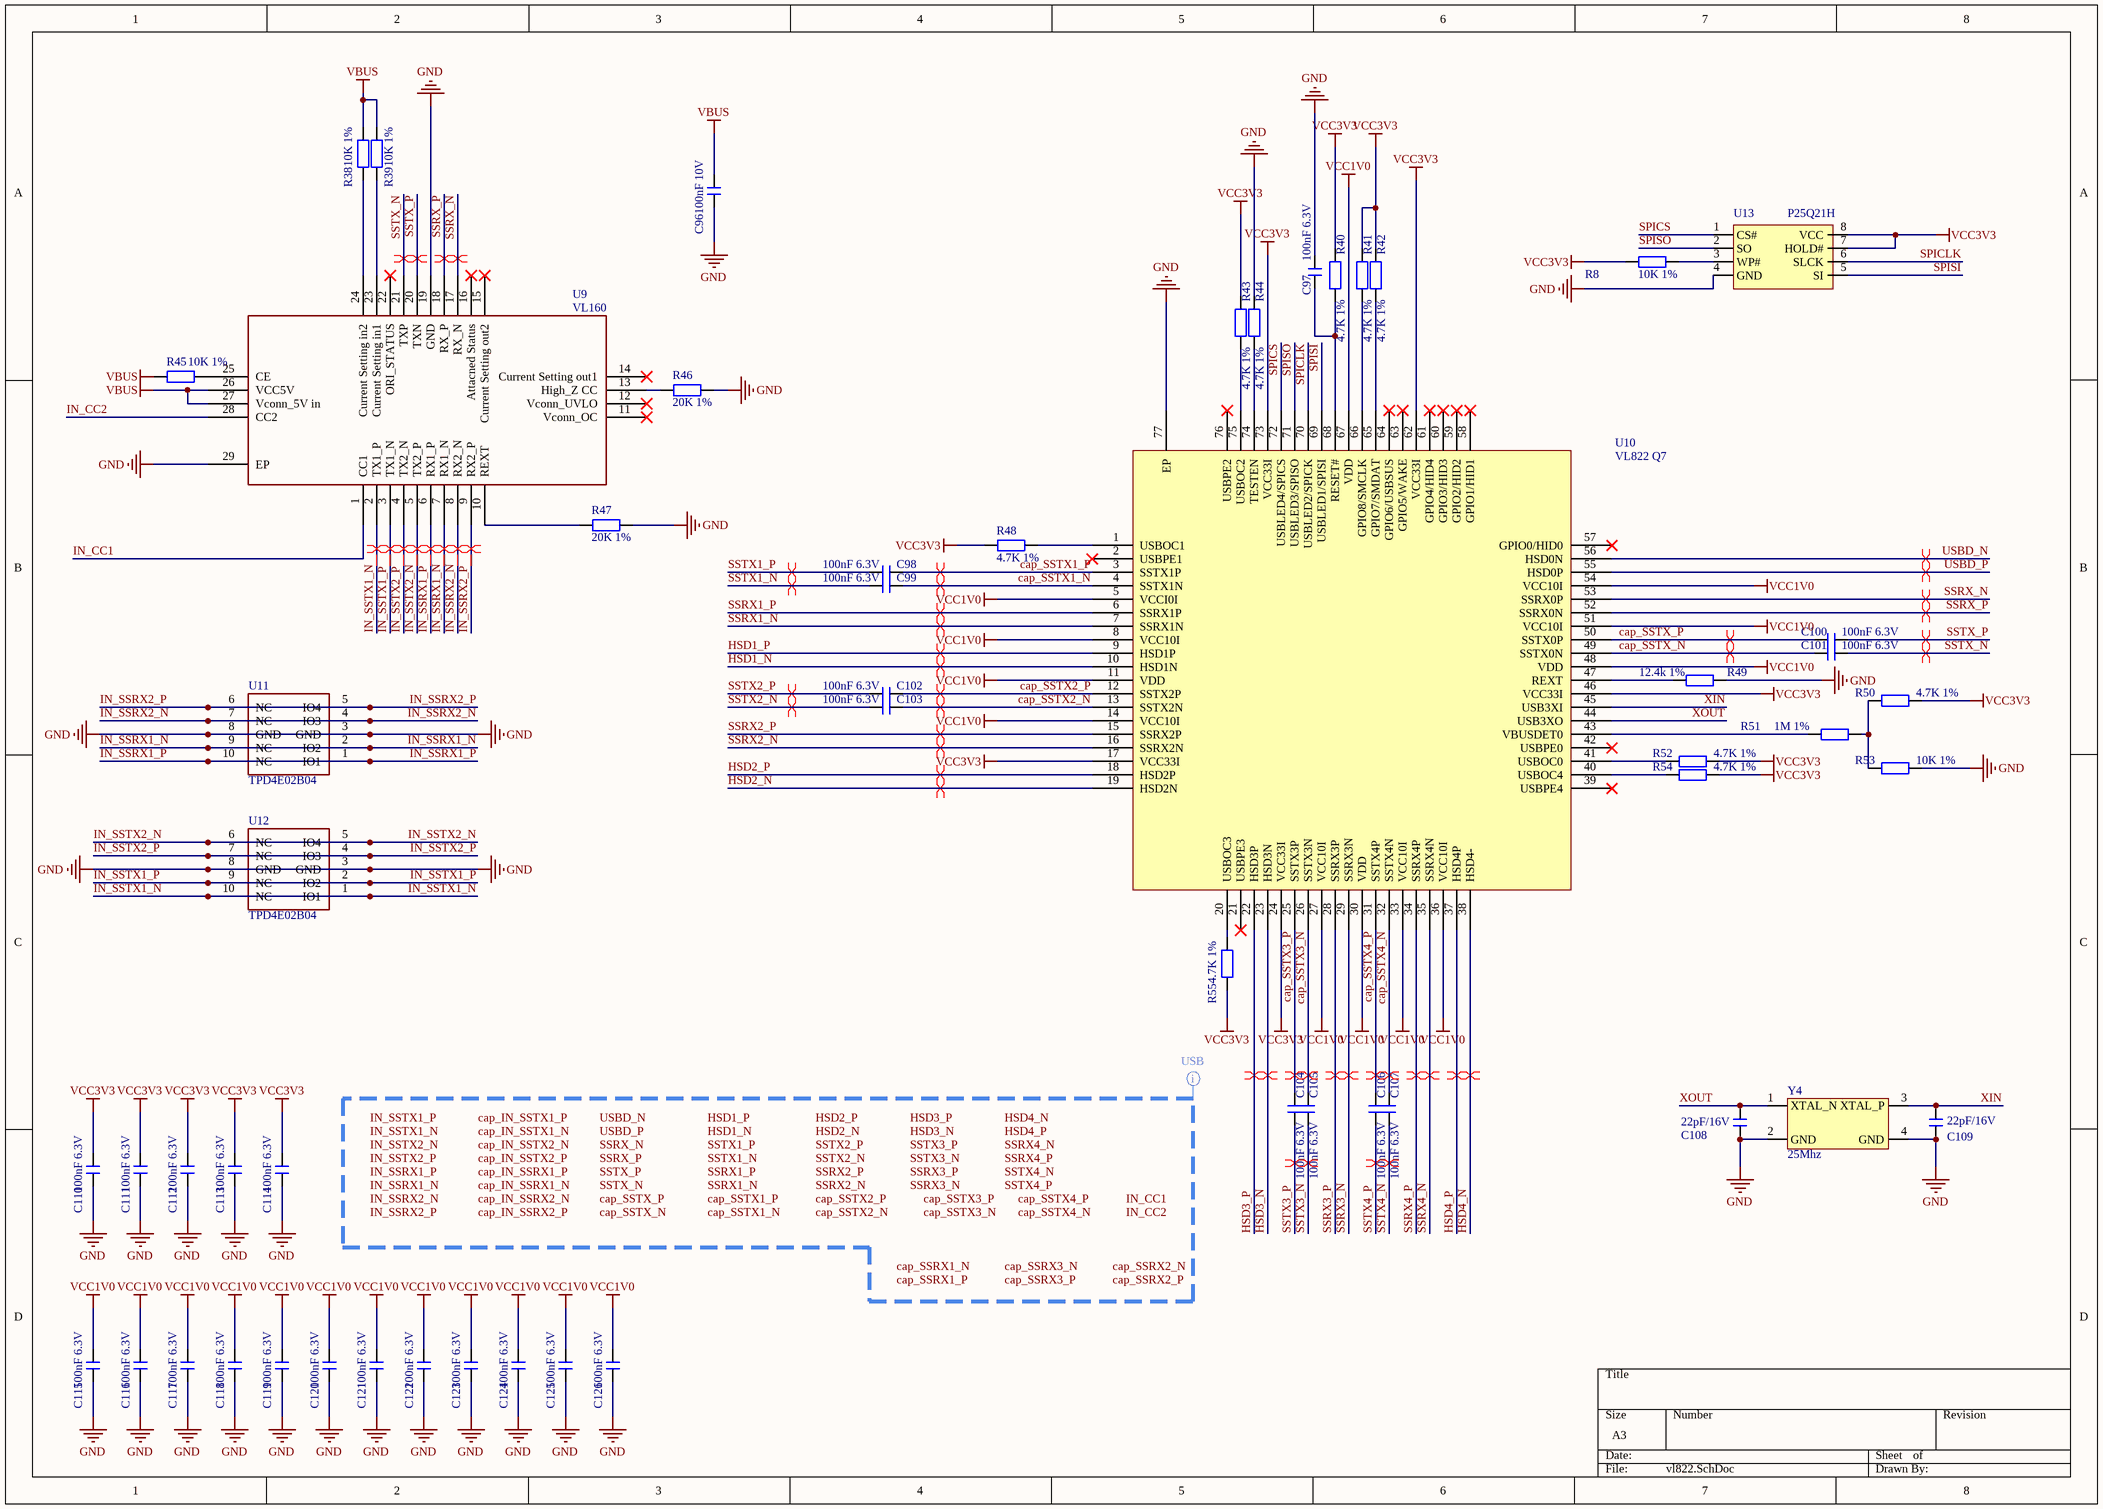
[diagram p4: vl822.SchDoc]

### Parts
C96  100nF 10V  [C0402_L]
C97  100nF 6.3V  [C0402_L]
C98  100nF 6.3V  [C0402_L]
C99  100nF 6.3V  [C0402_L]
C100  100nF 6.3V  [C0402_L]
C101  100nF 6.3V  [C0402_L]
C102  100nF 6.3V  [C0402_L]
C103  100nF 6.3V  [C0402_L]
C104  100nF 6.3V  [C0402_L]
C105  100nF 6.3V  [C0402_L]
C106  100nF 6.3V  [C0402_L]
C107  100nF 6.3V  [C0402_L]
C108  22pF/16V  [C0402_L]
C109  22pF/16V  [C0402_L]
C110  100nF 6.3V  [C0402_L]
C111  100nF 6.3V  [C0402_L]
C112  100nF 6.3V  [C0402_L]
C113  100nF 6.3V  [C0402_L]
C114  100nF 6.3V  [C0402_L]
C115  100nF 6.3V  [C0402_L]
C116  100nF 6.3V  [C0402_L]
C117  100nF 6.3V  [C0402_L]
C118  100nF 6.3V  [C0402_L]
C119  100nF 6.3V  [C0402_L]
C120  100nF 6.3V  [C0402_L]
C121  100nF 6.3V  [C0402_L]
C122  100nF 6.3V  [C0402_L]
C123  100nF 6.3V  [C0402_L]
C124  100nF 6.3V  [C0402_L]
C125  100nF 6.3V  [C0402_L]
C126  100nF 6.3V  [C0402_L]
R8  10K 1%  [R0402_L]
R38  10K 1%  [R0402_L]
R39  10K 1%  [R0402_L]
R40  4.7K 1%  [R0402_L]
R41  4.7K 1%  [R0402_L]
R42  4.7K 1%  [R0402_L]
R43  4.7K 1%  [R0402_L]
R44  4.7K 1%  [R0402_L]
R45  10K 1%  [R0402_L]
R46  20K 1%  [R0402_L]
R47  20K 1%  [R0402_L]
R48  4.7K 1%  [R0402_L]
R49  12.4k 1%  [R0402_L]
R50  4.7K 1%  [R0402_L]
R51  1M 1%  [R0402_L]
R52  4.7K 1%  [R0402_L]
R53  10K 1%  [R0402_L]
R54  4.7K 1%  [R0402_L]
R55  4.7K 1%  [R0402_L]
U9  VL160  [MQFN-28_L4.5-W3.5-P0.40-BL-EP]
U10  VL822 Q7  [QFN-76_L9.0-W9.0-P0.40-EP6.3-TL]
U11  TPD4E02B04  [DIO_TPD4E02B04DQAR]
U12  TPD4E02B04  [DIO_TPD4E02B04DQAR]
U13  P25Q21H  [SOP8_L]
Y4  25Mhz  [OSC 3225-4P]

### Nets
GND: C96.1 C97.2 C108.2 C109.2 C110.1 C111.1 C112.1 C113.1 C114.1 C115.1 C116.1 C117.1 C118.1 C119.1 C120.1 C121.1 C122.1 C123.1 C124.1 C125.1 C126.1 R44.2 R46.1 R47.1 R49.2 R53.2 U9.19(GND) U9.29(EP) U10.77(EP) U11.3(GND) U11.8(GND) U12.3(GND) U12.8(GND) U13.4(GND) Y4.2(GND) Y4.4(GND)
VBUS: C96.2 R38.1 R39.1 R45.2 U9.26(VCC5V) U9.27(Vconn_5V_in)
VCC1V0: C115.2 C116.2 C117.2 C118.2 C119.2 C120.2 C121.2 C122.2 C123.2 C124.2 C125.2 C126.2 U10.5(VCCI0I) U10.8(VCC10I) U10.11(VDD) U10.14(VCC10I) U10.27(VCC10I) U10.30(VDD) U10.33(VCC10I) U10.36(VCC10I) U10.48(VDD) U10.51(VCC10I) U10.54(VCC10I) U10.67(VDD)
VCC3V3: C110.2 C111.2 C112.2 C113.2 C114.2 R8.2 R40.2 R41.2 R42.2 R43.2 R48.2 R50.2 R52.2 R54.2 R55.2 U10.17(VCC33I) U10.24(VCC33I) U10.46(VCC33I) U10.62(VCC33I) U10.73(VCC33I) U13.7(HOLD#) U13.8(VCC)
cap_SSTX1_N: C99.2 U10.4(SSTX1N)
cap_SSTX1_P: C98.2 U10.3(SSTX1P)
cap_SSTX2_N: C103.2 U10.13(SSTX2N)
cap_SSTX2_P: C102.2 U10.12(SSTX2P)
cap_SSTX3_N: C105.2 U10.26(SSTX3N)
cap_SSTX3_P: C104.2 U10.25(SSTX3P)
cap_SSTX4_N: C107.2 U10.32(SSTX4N)
cap_SSTX4_P: C106.2 U10.31(SSTX4P)
cap_SSTX_N: C101.2 U10.49(SSTX0N)
cap_SSTX_P: C100.2 U10.50(SSTX0P)
HSD1_N: U10.10(HSD1N)
HSD1_P: U10.9(HSD1P)
HSD2_N: U10.19(HSD2N)
HSD2_P: U10.18(HSD2P)
HSD3_N: U10.23(HSD3N)
HSD3_P: U10.22(HSD3P)
HSD4_N: U10.38(HSD4-)
HSD4_P: U10.37(HSD4P)
IN_CC1: U9.1(CC1)
IN_CC2: U9.28(CC2)
IN_SSRX1_N: U9.7(RX1_N) U11.2(IO2) U11.9(NC)
IN_SSRX1_P: U9.6(RX1_P) U11.1(IO1) U11.10(NC)
IN_SSRX2_N: U9.8(RX2_N) U11.4(IO3) U11.7(NC)
IN_SSRX2_P: U9.9(RX2_P) U11.5(IO4) U11.6(NC)
IN_SSTX1_N: U9.2(TX1_P) U12.1(IO1) U12.10(NC)
IN_SSTX1_P: U9.3(TX1_N) U12.2(IO2) U12.9(NC)
IN_SSTX2_N: U9.5(TX2_P) U12.5(IO4) U12.6(NC)
IN_SSTX2_P: U9.4(TX2_N) U12.4(IO3) U12.7(NC)
SPICLK: U10.70(USBLED2/SPICK) U13.6(SLCK)
SPICS: U10.72(USBLED4/SPICS) U13.1(CS#)
SPISI: U10.69(USBLED1/SPISI) U13.5(SI)
SPISO: U10.71(USBLED3/SPISO) U13.2(SO)
SSRX1_N: U10.7(SSRX1N)
SSRX1_P: U10.6(SSRX1P)
SSRX2_N: U10.16(SSRX2N)
SSRX2_P: U10.15(SSRX2P)
SSRX3_N: U10.29(SSRX3N)
SSRX3_P: U10.28(SSRX3P)
SSRX4_N: U10.35(SSRX4N)
SSRX4_P: U10.34(SSRX4P)
SSRX_N: U9.17(RX_N) U10.53(SSRX0P)
SSRX_P: U9.18(RX_P) U10.52(SSRX0N)
SSTX1_N: C99.1
SSTX1_P: C98.1
SSTX2_N: C103.1
SSTX2_P: C102.1
SSTX3_N: C105.1
SSTX3_P: C104.1
SSTX4_N: C107.1
SSTX4_P: C106.1
SSTX_N: C101.1 U9.21(TXP)
SSTX_P: C100.1 U9.20(TXN)
USBD_N: U10.56(HSD0N)
USBD_P: U10.55(HSD0P)
XIN: C109.1 U10.45(USB3XI) Y4.3(XTAL_P)
XOUT: C108.1 U10.44(USB3XO) Y4.1(XTAL_N)
NetC97_1: C97.1 R40.1 U10.68(RESET#)
NetR8_1: R8.1 U13.3(WP#)
NetR38_2: R38.2 U9.24(Current_Setting_in2)
NetR39_2: R39.2 U9.23(Current_Setting_in1)
NetR41_1: R41.1 U10.66(GPIO8/SMCLK)
NetR42_1: R42.1 U10.65(GPIO7/SMDAT)
NetR43_1: R43.1 U10.75(USBOC2)
NetR44_1: R44.1 U10.74(TESTEN)
NetR45_1: R45.1 U9.25(CE)
NetR46_2: R46.2 U9.13(High_Z_CC)
NetR47_2: R47.2 U9.10(REXT)
NetR48_1: R48.1 U10.1(USBOC1)
NetR49_1: R49.1 U10.47(REXT)
NetR50_1: R50.1 R51.2 R53.1
NetR51_1: R51.1 U10.43(VBUSDET0)
NetR52_1: R52.1 U10.41(USBOC0)
NetR54_1: R54.1 U10.40(USBOC4)
NetR55_1: R55.1 U10.20(USBOC3)

Not connected (* = marked no-connect by the designer): U9 11(Vconn_OC)* 12(Vconn_UVLO)* 14(Current_Setting_out1)* 15(Current_Setting_out2)* 16(Attacned_Status)* 22(ORI_STATUS)*; U10 2(USBPE1)* 21(USBPE3)* 39(USBPE4)* 42(USBPE0)* 57(GPIO0/HID0)* 58(GPIO1/HID1)* 59(GPIO2/HID2)* 60(GPIO3/HID3)* 61(GPIO4/HID4)* 63(GPIO5/WAKE)* 64(GPIO6/USBSUS)* 76(USBPE2)*

### Layout directives
differential pair: cap_SSTX1_N, cap_SSTX1_P, cap_SSTX2_N, cap_SSTX2_P, cap_SSTX3_N, cap_SSTX3_P, cap_SSTX4_N, cap_SSTX4_P, cap_SSTX_N, cap_SSTX_P, HSD1_N, HSD1_P, HSD2_N, HSD2_P, HSD3_N, HSD3_P, HSD4_N, HSD4_P, IN_SSRX1_N, IN_SSRX1_P, IN_SSRX2_N, IN_SSRX2_P, IN_SSTX1_N, IN_SSTX1_P, IN_SSTX2_N, IN_SSTX2_P, SSRX1_N, SSRX1_P, SSRX2_N, SSRX2_P, SSRX3_N, SSRX3_P, SSRX4_N, SSRX4_P, SSRX_N, SSRX_P, SSTX1_N, SSTX1_P, SSTX2_N, SSTX2_P, SSTX3_N, SSTX3_P, SSTX4_N, SSTX4_P, SSTX_N, SSTX_P, USBD_N, USBD_P
net class USB; rule Differential Pairs Routing [Pref Gap = 5mil    Min Gap  = 5mil    Max Gap  = 5milPref Width = 5.1mil    Min Width  = 5.1mil    Max Width  = 5.1mil]; rule Routing Via Style [Pref Size = 0.4mm    Pref Hole Size = 0.3mm]: cap_IN_SSRX1_N, cap_IN_SSRX1_P, cap_IN_SSRX2_N, cap_IN_SSRX2_P, cap_IN_SSTX1_N, cap_IN_SSTX1_P, cap_IN_SSTX2_N, cap_IN_SSTX2_P, cap_SSRX1_N, cap_SSRX1_P, cap_SSRX2_N, cap_SSRX2_P, cap_SSRX3_N, cap_SSRX3_P, cap_SSTX1_N, cap_SSTX1_P, cap_SSTX2_N, cap_SSTX2_P, cap_SSTX3_N, cap_SSTX3_P, cap_SSTX4_N, cap_SSTX4_P, cap_SSTX_N, cap_SSTX_P, HSD1_N, HSD1_P, HSD2_N, HSD2_P, HSD3_N, HSD3_P, HSD4_N, HSD4_P, IN_CC1, IN_CC2, IN_SSRX1_N, IN_SSRX1_P, IN_SSRX2_N, IN_SSRX2_P, IN_SSTX1_N, IN_SSTX1_P, IN_SSTX2_N, IN_SSTX2_P, SSRX1_N, SSRX1_P, SSRX2_N, SSRX2_P, SSRX3_N, SSRX3_P, SSRX4_N, SSRX4_P, SSRX_N, SSRX_P, SSTX1_N, SSTX1_P, SSTX2_N, SSTX2_P, SSTX3_N, SSTX3_P, SSTX4_N, SSTX4_P, SSTX_N, SSTX_P, USBD_N, USBD_P

### Notes on the sheet
- Labels drawn without touching a wire or pin: cap_IN_SSRX1_N, cap_IN_SSRX1_P, cap_IN_SSRX2_N, cap_IN_SSRX2_P, cap_IN_SSTX1_N, cap_IN_SSTX1_P, cap_IN_SSTX2_N, cap_IN_SSTX2_P, cap_SSRX1_N, cap_SSRX1_P, cap_SSRX2_N, cap_SSRX2_P, cap_SSRX3_N, cap_SSRX3_P, cap_SSTX1_N, cap_SSTX1_P, cap_SSTX2_N, cap_SSTX2_P, cap_SSTX3_N, cap_SSTX3_P, cap_SSTX4_N, cap_SSTX4_P, cap_SSTX_N, cap_SSTX_P, HSD1_N, HSD1_P, HSD2_N, HSD2_P, HSD3_N, HSD3_P, HSD4_N, HSD4_P, IN_CC1, IN_CC2, IN_SSRX1_N, IN_SSRX1_P, IN_SSRX2_N, IN_SSRX2_P, IN_SSTX1_N, IN_SSTX1_P, IN_SSTX2_N, IN_SSTX2_P, SSRX1_N, SSRX1_P, SSRX2_N, SSRX2_P, SSRX3_N, SSRX3_P, SSRX4_N, SSRX4_P, SSRX_N, SSRX_P, SSTX1_N, SSTX1_P, SSTX2_N, SSTX2_P, SSTX3_N, SSTX3_P, SSTX4_N, SSTX4_P, SSTX_N, SSTX_P, USBD_N, USBD_P

### Library data of the parts
C96-C126 = C: 无极性贴片电容; 版权归属: 源创客; 材质: X7R; BOM名称: 无极性贴片电容; 学习资源: www.ooocke.com
R8 R38-R55 = R: 贴片电阻; 版权归属: 源创客; BOM名称: 贴片电阻; 学习资源: www.ooocke.com
U11 U12 = TPD4E02B04: ESD
U13 = P25D40H
Y4 = Crystal

## Nets that join several sheets
GND: pwr (37 pins), connector (39 pins), jmb575 (84 pins), vl822 (36 pins)
VBUS: pwr (5 pins), connector (5 pins), jmb575 (12 pins), vl822 (6 pins)
VCC1V0: pwr (C14.2 C15.2 L2.1 R14.1), vl822 (24 pins)
VCC3V3: pwr (C16.2 C17.2 L3.1 R15.1), connector (6 pins), vl822 (22 pins)
VCC5V: pwr (13 pins), connector (9 pins)
VCC12V: pwr (13 pins), connector (9 pins)
VIN: pwr (C127.1 Q1.2 R11.1), connector (CON1.1)
GPIO4-A: connector (LED4.2), jmb575 (U3.8)
GPIO4-B: connector (LED6.2), jmb575 (U4.8)
GPIO4-C: connector (LED8.2), jmb575 (U7.8)
HSD1_N: jmb575 (U3.13), vl822 (U10.10)
HSD1_P: jmb575 (U3.15), vl822 (U10.9)
HSD2_N: jmb575 (U4.13), vl822 (U10.19)
HSD2_P: jmb575 (U4.15), vl822 (U10.18)
HSD3_N: connector (J5.2), vl822 (U10.23)
HSD3_P: connector (J5.3), vl822 (U10.22)
HSD4_N: jmb575 (U7.13), vl822 (U10.38)
HSD4_P: jmb575 (U7.15), vl822 (U10.37)
IN_CC1: connector (J4.A5), vl822 (U9.1)
IN_CC2: connector (J4.B5), vl822 (U9.28)
IN_SSRX1_N: connector (J4.B11), vl822 (U9.7 U11.2 U11.9)
IN_SSRX1_P: connector (J4.B10), vl822 (U9.6 U11.1 U11.10)
IN_SSRX2_N: connector (J4.A10), vl822 (U9.8 U11.4 U11.7)
IN_SSRX2_P: connector (J4.A11), vl822 (U9.9 U11.5 U11.6)
IN_SSTX1_N: connector (J4.A3), vl822 (U9.2 U12.1 U12.10)
IN_SSTX1_P: connector (J4.A2), vl822 (U9.3 U12.2 U12.9)
IN_SSTX2_N: connector (J4.B2), vl822 (U9.5 U12.5 U12.6)
IN_SSTX2_P: connector (J4.B3), vl822 (U9.4 U12.4 U12.7)
RX1_N: connector (C26.2), jmb575 (U3.31)
RX1_P: connector (C29.2), jmb575 (U3.30)
RX2_N: connector (C25.2), jmb575 (U4.31)
RX2_P: connector (C28.2), jmb575 (U4.30)
RX3_N: connector (C24.2), jmb575 (U7.31)
RX3_P: connector (C27.2), jmb575 (U7.30)
SSRX1_N: jmb575 (C66.1), vl822 (U10.7)
SSRX1_P: jmb575 (C68.1), vl822 (U10.6)
SSRX2_N: jmb575 (C67.1), vl822 (U10.16)
SSRX2_P: jmb575 (C69.1), vl822 (U10.15)
SSRX3_N: connector (J5.5), vl822 (U10.29)
SSRX3_P: connector (J5.6), vl822 (U10.28)
SSRX4_N: jmb575 (C92.1), vl822 (U10.35)
SSRX4_P: jmb575 (C93.1), vl822 (U10.34)
SSTX1_N: jmb575 (U3.22), vl822 (C99.1)
SSTX1_P: jmb575 (U3.23), vl822 (C98.1)
SSTX2_N: jmb575 (U4.22), vl822 (C103.1)
SSTX2_P: jmb575 (U4.23), vl822 (C102.1)
SSTX3_N: connector (J5.9), vl822 (C105.1)
SSTX3_P: connector (J5.8), vl822 (C104.1)
SSTX4_N: jmb575 (U7.22), vl822 (C107.1)
SSTX4_P: jmb575 (U7.23), vl822 (C106.1)
TX1_N: connector (C23.2), jmb575 (U3.33)
TX1_P: connector (C20.2), jmb575 (U3.34)
TX2_N: connector (C22.2), jmb575 (U4.33)
TX2_P: connector (C19.2), jmb575 (U4.34)
TX3_N: connector (C21.2), jmb575 (U7.33)
TX3_P: connector (C18.2), jmb575 (U7.34)
USBD_N: connector (J4.A7 J4.B7), vl822 (U10.56)
USBD_P: connector (J4.A6 J4.B6), vl822 (U10.55)